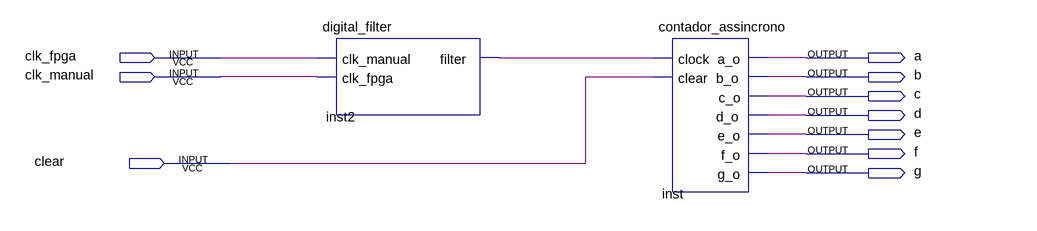
[diagram p0: schematic sheet]
// Quartus schematic filtered_up_down_counter.bdf as structural Verilog: 2 symbols, 10 pins
module filtered_up_down_counter (
  input  clk_fpga,
  input  clk_manual,
  input  clear,
  output a,
  output b,
  output c,
  output d,
  output e,
  output f,
  output g
);

  wire inst2_filter;

  digital_filter inst2 (.clk_manual(clk_fpga), .clk_fpga(clk_manual), .filter(inst2_filter));
  contador_assincrono inst (
    .clock(inst2_filter), .clear(clear), .a_o(a), .b_o(b), .c_o(c), .d_o(d), .e_o(e), .f_o(f), .g_o(g));
endmodule
